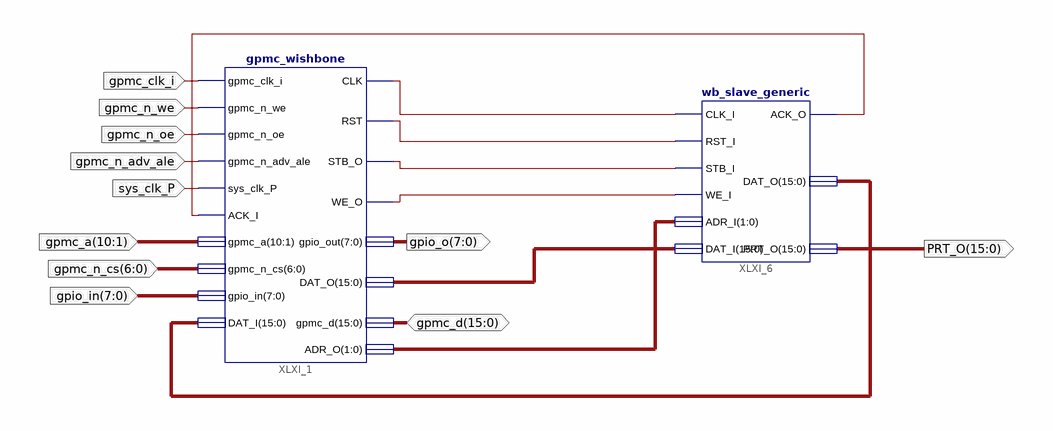
[diagram p0: schematic sheet 1]
// Xilinx ISE schematic top_level_schematic.sch (spartan6) as structural Verilog: 2 symbols, 11 ports
module top_level_schematic (
  input  gpmc_clk_i,
  input  gpmc_n_we,
  input  gpmc_n_oe,
  input  gpmc_n_adv_ale,
  input  sys_clk_P,
  input  [10:1] gpmc_a,
  input  [6:0] gpmc_n_cs,
  input  [7:0] gpio_in,
  inout  [15:0] gpmc_d,
  output [7:0] gpio_o,
  output [15:0] PRT_O
);

  wire XLXN_1, XLXN_2, XLXN_3, XLXN_4, XLXN_8;
  wire [1:0] XLXN_23;
  wire [15:0] XLXN_17, XLXN_21;

  gpmc_wishbone XLXI_1 (
    .gpmc_clk_i(gpmc_clk_i), .gpmc_n_we(gpmc_n_we), .gpmc_n_oe(gpmc_n_oe), .gpmc_n_adv_ale(gpmc_n_adv_ale),
    .sys_clk_P(sys_clk_P), .ACK_I(XLXN_8), .gpmc_a(gpmc_a), .gpmc_n_cs(gpmc_n_cs), .gpio_in(gpio_in),
    .DAT_I(XLXN_21), .gpmc_d(gpmc_d), .CLK(XLXN_1), .RST(XLXN_2), .STB_O(XLXN_3), .WE_O(XLXN_4),
    .gpio_out(gpio_o), .ADR_O(XLXN_23), .DAT_O(XLXN_17));
  wb_slave_generic XLXI_6 (
    .CLK_I(XLXN_1), .RST_I(XLXN_2), .STB_I(XLXN_3), .WE_I(XLXN_4), .ADR_I(XLXN_23), .DAT_I(XLXN_17),
    .ACK_O(XLXN_8), .DAT_O(XLXN_21), .PRT_O(PRT_O));
endmodule
